# EAGLE design mother_board (EAGLE 7.5.0)
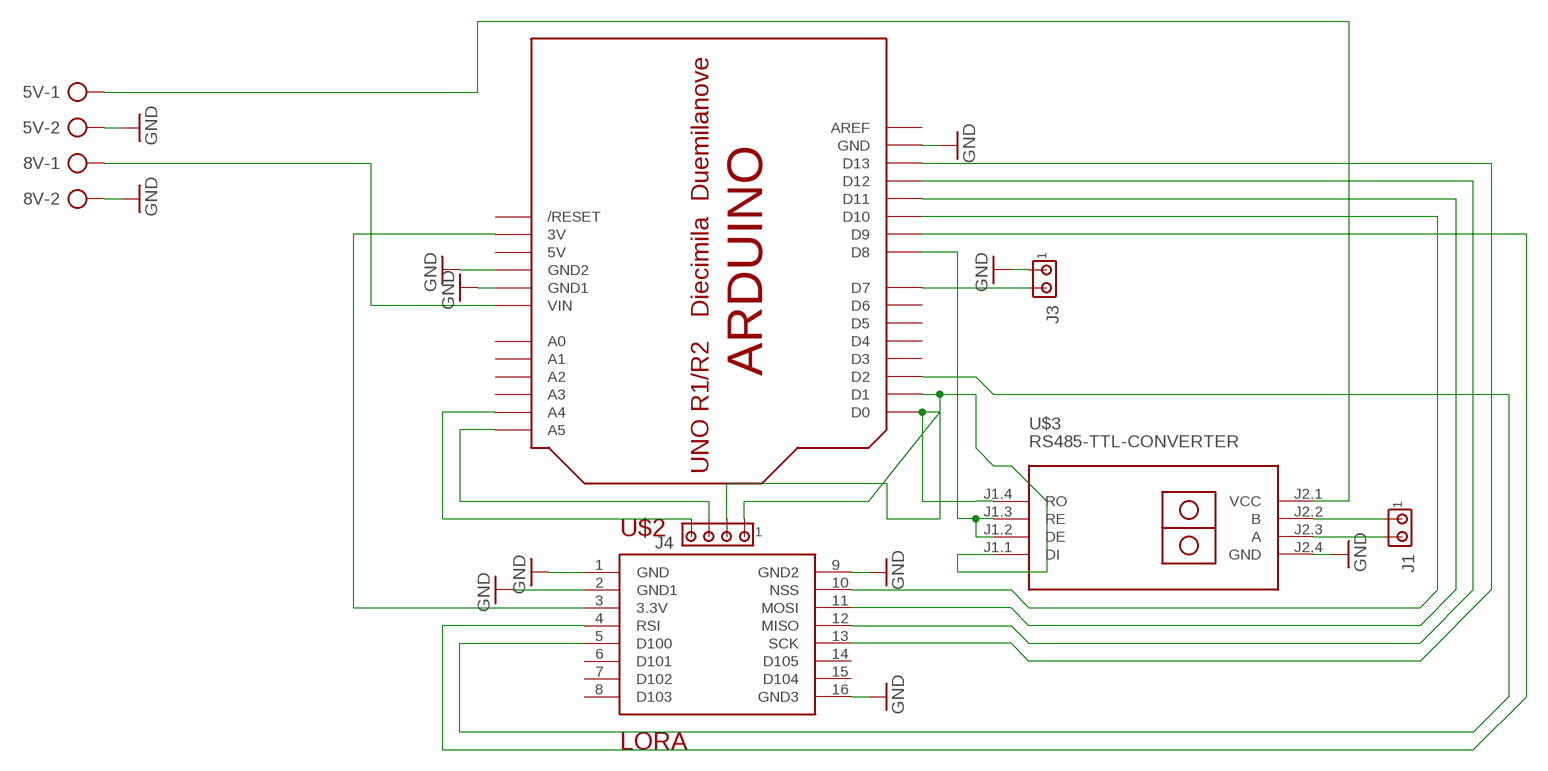
[diagram p0: schematic, sheet 1]

## Parts
5V  AK300/2  [AK300/2]
8V  AK300/2  [AK300/2]
J1  MTA02-100  [10X02MTA]
J3  MTA02-100  [10X02MTA]
J4  MTA04-100  [10X04MTA]
U$1  ARDUINOUNO  [ARDUINO]
U$2  LORA  [SX1278]
U$3  RS485-TTL-CONVERTER  [RS485-TTL-CONVERTER]

## Nets
GND: 5V.2 8V.2 J3.1 U$1.GND U$1.GND1 U$1.GND2 U$2.1(GND) U$2.2(GND1) U$2.9(GND2) U$2.16(GND3) U$3.J2.4(GND)
N$1: U$1.3V U$2.3(3.3V)
N$2: 8V.1 U$1.VIN
N$3: 5V.1 U$3.J2.1(VCC)
N$4: J1.2 U$3.J2.3(A)
N$5: J1.1 U$3.J2.2(B)
N$6: U$1.D8 U$3.J1.2(DE) U$3.J1.3(RE)
N$7: U$1.D10 U$2.10(NSS)
N$8: U$1.D11 U$2.11(MOSI)
N$9: U$1.D12 U$2.12(MISO)
N$10: U$1.D13 U$2.13(SCK)
N$11: U$1.D2 U$2.5(D100)
N$12: U$1.D9 U$2.4(RSI)
N$13: J4.4 U$1.A4
N$14: J4.3 U$1.A5
N$15: J4.1 U$1.D0
N$16: J4.2 U$1.D1 U$3.J1.1(DI)
N$17: U$3.J1.4(RO)
N$18: J3.2 U$1.D7
Unconnected: U$1.A0 U$1.A1 U$1.A2 U$1.A3 U$1.AREF U$1.D3 U$1.D4 U$1.D5 U$1.D6 U$1.RESET(/RESET) U$2.6(D101) U$2.7(D102) U$2.8(D103) U$2.14(D105) U$2.15(D104)

## Power pins joined to a net without a drawn wire
5V: U$1.5V

## Library data of the parts
5V 8V = con-ptr500:AK300/2: CONNECTOR; OC_FARNELL: unknown; OC_NEWARK: unknown
J1 J3 = con-amp:MTA02-100: AMP connector
J4 = con-amp:MTA04-100: AMP connector
U$1 = adafruit:ARDUINO: Arduino Diecimila/Duemilanove Make a shield with ease, this package has all the named pins as well as the two mounting drill holes and an outline of the USB and DC power connector. The outline is on the DIMENSION layer, so if your board house uses it they will cut the outline to match. http://www.ladyada.net/library/pcb/eaglelibrary.html
U$2 = lora:LORA
U$3 = diy-modules:RS485-TTL-CONVERTER: RS485 to TTL converter based on MAX485 chip

## Board
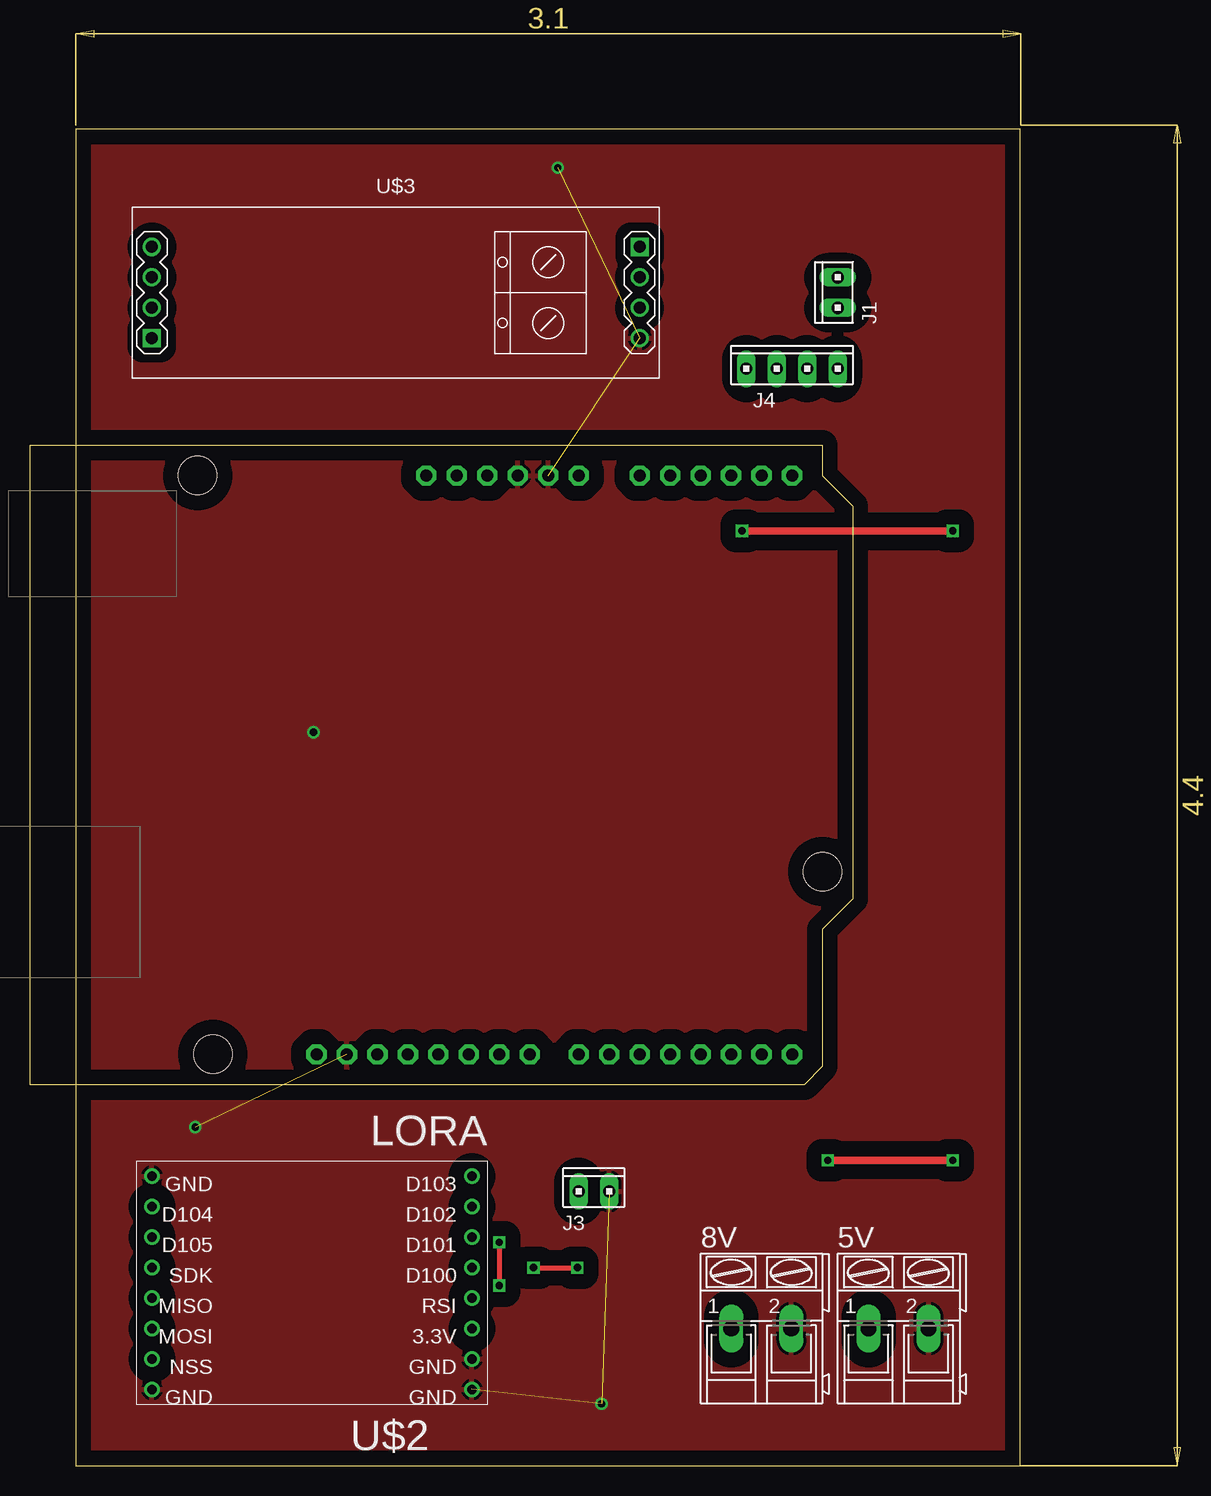
[diagram p1: board, top side]
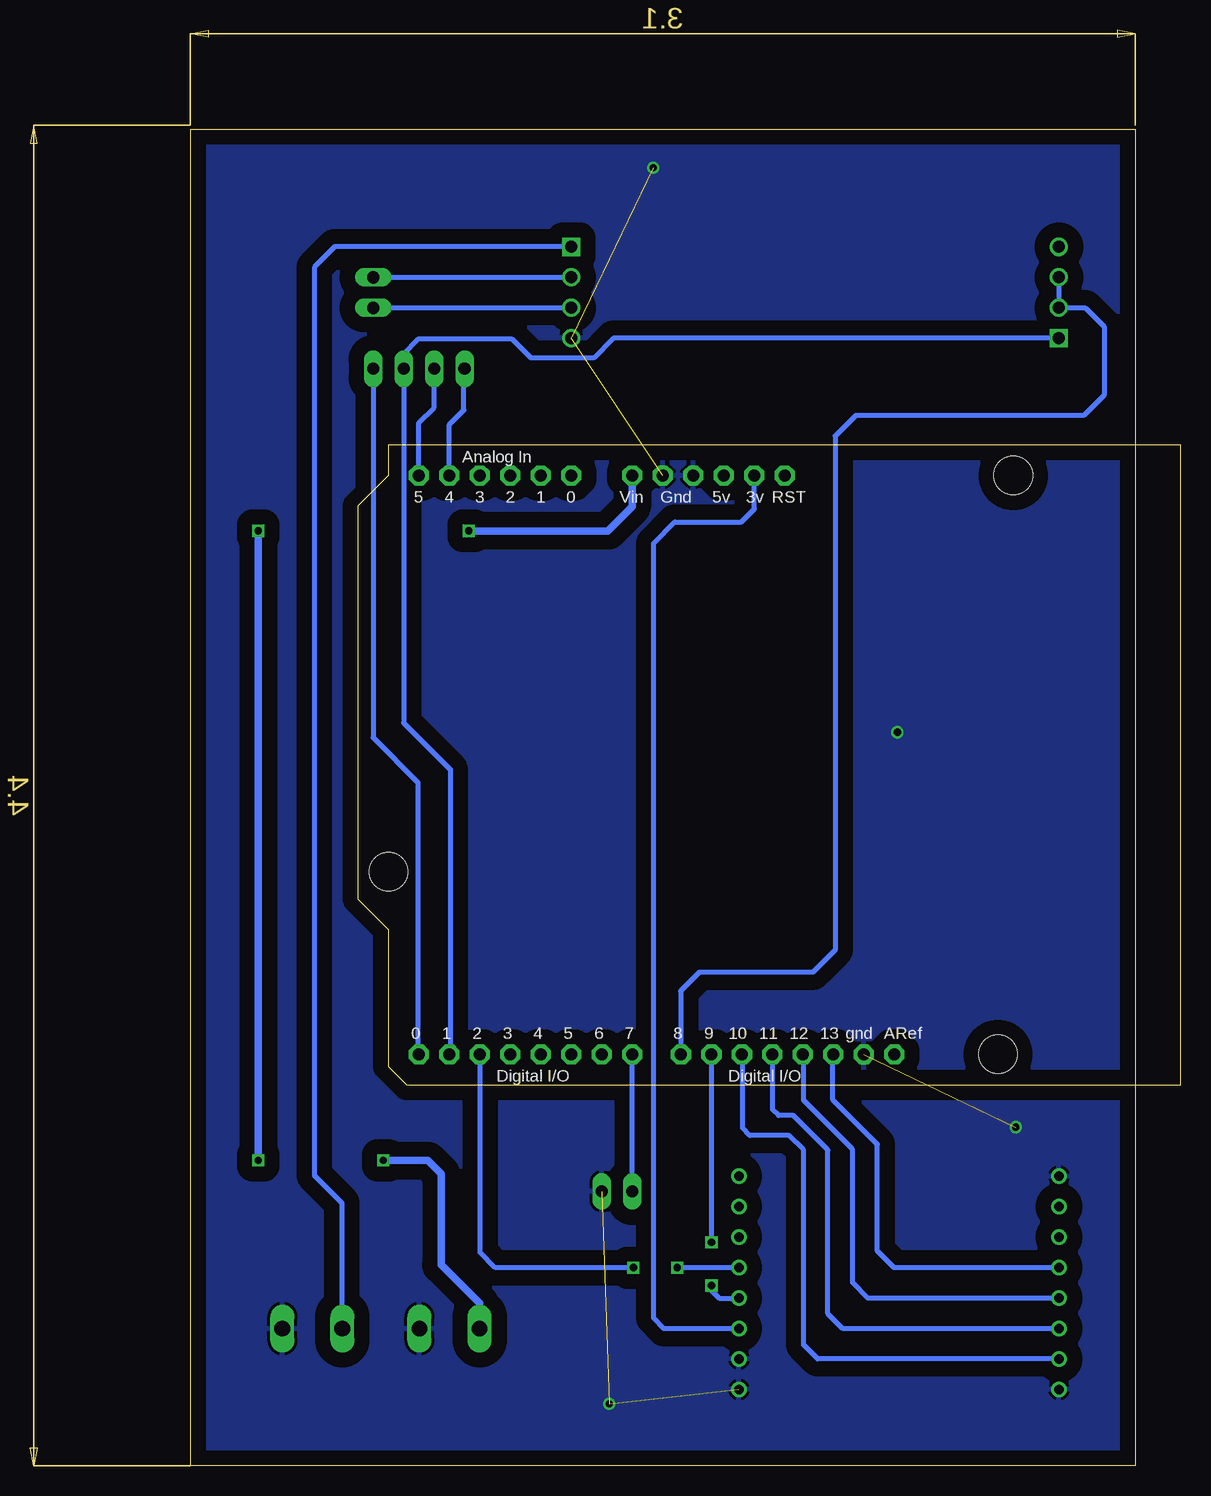
[diagram p2: board, bottom side, seen from below]

Size 78.72 x 111.43 mm. Coordinates in mm from the lower left corner, seen from the top.
Outline: 0,0 78.72,0 78.72,111.43 0,111.43 0,0
Copper layers (1*16): Top 0.035mm / dielectric 1.5mm / Bottom 0.035mm
Design rules "default": minimum track width 10mil, minimum drill 24mil, track to track 8mil, track to pad 8mil, pad to pad 8mil, via to via 8mil, smd to smd 8mil, copper to edge 40mil, drill to drill 8mil, minimum pad ring 10mil, minimum via ring 8mil, stop-mask expansion 4mil, vias tented up to drill 0mil, thermal gap 10mil

### Footprints (pad centres in the part's own frame; a part is rotated, then mirrored left to right if it is on the bottom)
AK300/2 = drill 1.321 long: 1 -2.515,0; 2 2.489,0
10X02MTA = drill 1.016 long: 1 1.27,0; 2 -1.27,0
10X04MTA = drill 1.016 long: 1 3.81,0; 2 1.27,0; 3 -1.27,0; 4 -3.81,0
ARDUINO = drill 1 pad 1.676 octagon: 3V 35.56,2.54; 5V 38.1,2.54; A0 50.8,2.54; A1 53.34,2.54; A2 55.88,2.54; A3 58.42,2.54; A4 60.96,2.54; A5 63.5,2.54; AREF 23.876,50.8; D0 63.5,50.8; D1 60.96,50.8; D2 58.42,50.8; D3 55.88,50.8; D4 53.34,50.8; D5 50.8,50.8; D6 48.26,50.8; D7 45.72,50.8; D8 41.656,50.8; D9 39.116,50.8; D10 36.576,50.8; D11 34.036,50.8; D12 31.496,50.8; D13 28.956,50.8; GND 26.416,50.8; GND1 43.18,2.54; GND2 40.64,2.54; RESET 33.02,2.54; VIN 45.72,2.54 | hole 3.2: 15.24,50.8; 66.04,35.56; 13.97,2.54
SX1278 = drill 0.8: 1 1.27,19.05; 2 1.27,16.51; 3 1.27,13.97; 4 1.27,11.43; 5 1.27,8.89; 6 1.27,6.35; 7 1.27,3.81; 8 1.27,1.27; 9 27.94,19.05; 10 27.94,16.51; 11 27.94,13.97; 12 27.94,11.43; 13 27.94,8.89; 14 27.94,6.35; 15 27.94,3.81; 16 27.94,1.27
RS485-TTL-CONVERTER = drill 1 square: J1.1 -20.32,-3.81; J2.1 20.32,3.81 | drill 1: J1.2 -20.32,-1.27; J1.3 -20.32,1.27; J1.4 -20.32,3.81; J2.2 20.32,1.27; J2.3 20.32,-1.27; J2.4 20.32,-3.81

### Placement (x,y rotation side)
5V  68.58,11.43 0 top
8V  57.15,11.43 0 top
J1  63.5,97.79 90 top
J3  43.18,22.86 0 top
J4  59.69,91.44 0 top
U$1  -3.81,85.09 180 bottom
U$2  34.29,25.4 180 top
U$3  26.67,97.79 0 top

### Tracks (layer width: path | path; a pad name or v marks a point on that pad's centre or on a via)
GND  (via drill 0.6)  (5 unrouted)
  other vias: 40.16,108.2 19.81,61.14 9.96,28.22 43.81,5.16
  pour Bottom (isolate 1.27): 0,111.76 78.74,111.76 78.74,0 0,0
  pour Top (isolate 1.27): -1.37,113.39 82.27,113.39 82.27,-1.8 -1.37,-1.8
N$1
  Bottom 0.406: U$2.3 39.24,11.43 40.13,12.32 40.13,76.89 38.35,78.66 32.82,78.66 31.73,79.76 31.73,82.53 U$1.3V
N$2  (via drill 0.6)
  Top 0.61: v55.52,77.93 v73.08,77.93 | v73.08,25.45 v62.66,25.45
  Bottom 0.61: U$1.VIN 41.91,79.96 43.94,77.93 v55.52,77.93 | v73.08,77.93 v73.08,25.45 | v62.66,25.45 58.95,25.45 57.84,24.33 57.84,16.74 54.63,13.54 8V.1
N$3
  Bottom 0.406: U$3.J2.1 66.7,101.6 68.4,99.9 68.4,24.18 66.12,21.89 66.12,11.48 5V.1
N$4
  Bottom 0.406: J1.2 U$3.J2.3
N$5
  Bottom 0.406: J1.1 U$3.J2.2
N$6
  Bottom 0.406: U$3.J1.3 U$3.J1.2 4.17,96.52 2.59,94.95 2.59,89.26 4.29,87.55 23.27,87.55 24.99,85.83 24.99,42.98 26.85,41.12 36.32,41.12 37.87,39.57 37.87,34.31 U$1.D8
N$7
  Bottom 0.406: U$2.10 26.47,8.89 27.64,10.06 27.64,26.31 28.85,27.53 32.11,27.53 32.72,28.14 32.72,34.24 U$1.D10
N$8
  Bottom 0.406: U$2.11 24.36,11.43 25.6,12.68 25.6,26.31 28.47,29.18 29.72,29.18 30.2,29.67 30.2,34.26 U$1.D11
N$9
  Bottom 0.406: U$2.12 22.25,13.97 23.55,15.27 23.55,26.37 27.64,30.46 27.64,34.24 U$1.D12
N$10
  Bottom 0.406: U$2.13 20.09,16.51 21.49,17.91 21.49,26.8 25.2,30.5 25.2,34.24 U$1.D13
N$11  (via drill 0.6)
  Top 0.406: v38.15,16.51 v41.81,16.51
  Bottom 0.406: U$2.5 v38.15,16.51 | v41.81,16.51 53.31,16.51 54.59,17.78 54.59,34.26 U$1.D2
N$12  (via drill 0.6)
  Top 0.406: v35.31,18.62 v35.31,15.01
  Bottom 0.406: U$1.D9 v35.31,18.62 | v35.31,15.01 35.31,14.63 34.65,13.97 U$2.4
N$13
  Bottom 0.406: U$1.A4 57.15,86.77 55.93,87.99 55.93,91.39 J4.4
N$14
  Bottom 0.406: U$1.A5 59.69,86.94 58.42,88.21 J4.3
N$15
  Bottom 0.406: J4.1 63.5,60.68 59.77,56.95 59.77,34.37 U$1.D0
N$16
  Bottom 0.406: U$1.D1 57.07,34.37 57.07,58.04 60.96,61.92 J4.2 61.01,91.49 61.01,92.66 59.77,93.9 51.92,93.9 50.34,92.33 45.14,92.33 43.48,93.98 U$3.J1.1
N$18
  Bottom 0.406: J3.2 U$1.D7